# Altium schematic sheet OM-O2P-ETH.SchDoc
size A3
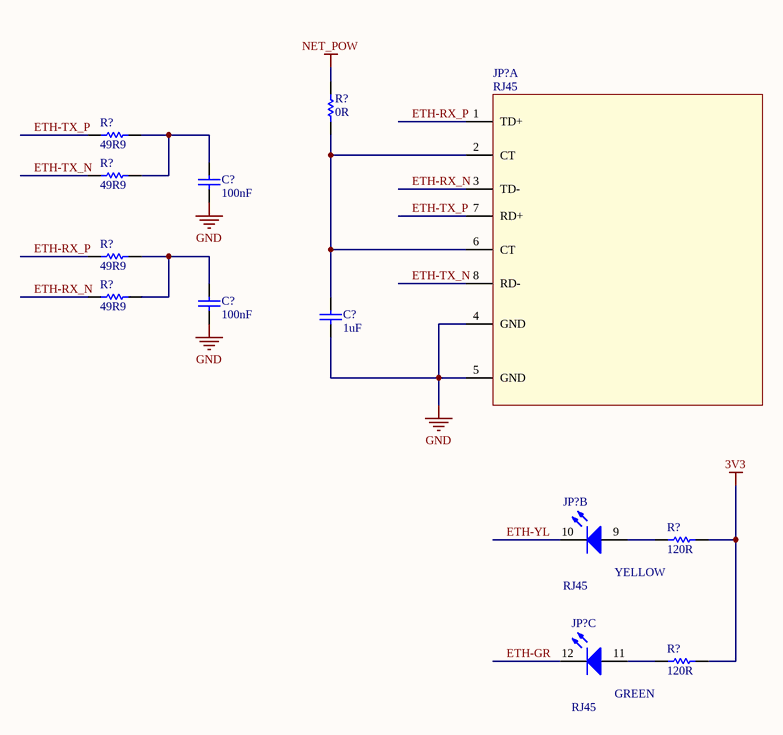
[diagram p0: OM-O2P-ETH.SchDoc]

## Parts
(Parts that share a designator on the sheet are numbered #1, #2 ... from top to bottom, then left to right.)
C?#1  value 100nF  [CAPC0805(2012)100_M]  (hidden comment: CAP 100nF 16V 0805(2012))
C?#2  value 100nF  [CAPC0805(2012)100_M]  (hidden comment: CAP 100nF 16V 0805(2012))
C?#3  value 1uF  [CAPC0805(2012)145_N]  (hidden comment: CAP 1uF 16V 0805(2012))
JP?#1  RJ45  [j0026d21bnl]  (part A of 3)
JP?#2  RJ45  [j0026d21bnl]  (part B of 3)
JP?#3  RJ45  [j0026d21bnl]  (part C of 3)
R?#1  value 0R  [RESC0402(1005)_N]  (hidden comment: Jumper 0402(1005))
R?#2  value 49R9  [RESC0805(2012)_N]  (hidden comment: 49R9 1% 0805(2012))
R?#3  value 49R9  [RESC0805(2012)_N]  (hidden comment: 49R9 1% 0805(2012))
R?#4  value 49R9  [RESC0805(2012)_N]  (hidden comment: 49R9 1% 0805(2012))
R?#5  value 49R9  [RESC0805(2012)_N]  (hidden comment: 49R9 1% 0805(2012))
R?#6  value 120R  [RESC0805(2012)_N]  (hidden comment: 120R 5% 0805(2012))
R?#7  value 120R  [RESC0805(2012)_N]  (hidden comment: 120R 5% 0805(2012))

## Nets
3V3: R?#6.1 R?#7.1
GND: C?#1.1 C?#2.1 C?#3.1 JP?#1.4(GND) JP?#1.5(GND)
NET_POW: R?#1.1
ETH-GR: JP?#3.12(K)
ETH-RX_N: JP?#1.3(TD-) R?#5.1
ETH-RX_P: JP?#1.1(TD+) R?#4.1
ETH-TX_N: JP?#1.8(RD-) R?#3.1
ETH-TX_P: JP?#1.7(RD+) R?#2.1
ETH-YL: JP?#2.10(K)
NetC?#1_2: C?#1.2 R?#2.2 R?#3.2
NetC?#2_2: C?#2.2 R?#4.2 R?#5.2
NetC?#3_2: C?#3.2 JP?#1.2(CT) JP?#1.6(CT) R?#1.2
NetJP?#2_9: JP?#2.9(A) R?#6.2
NetJP?#3_11: JP?#3.11(A) R?#7.2

## Notes on the sheet
- (in symbol CONN_RJ45_J0026D21BNL, part B) YELLOW
- (in symbol CONN_RJ45_J0026D21BNL, part C) GREEN

## Library data of the parts
C?#1 C?#2 = CMP-1036-04400-1: CAP 100nF 16V ±5% 0805 (2012 Metric) Thickness 1mm SMD; Case-EIA: 0805; Tolerance: Â±5%; Case-Metric: 2012; Max Thickness: 1 mm; Technology: SMT; Rated Voltage: 16 V
C?#3 = CMP-1036-04748-1: CAP 1uF 16V ±20% 0805 (2012 Metric) Thickness 1.45mm SMD; Tolerance: Â±20%; Case-Metric: 2012; Case-EIA: 0805; Technology: SMT; Rated Voltage: 16 V; Max Thickness: 1.45 mm
JP?#1-JP?#3 = CONN_RJ45_J0026D21BNL: 1 Port RJ45 Magjack Connector Panel Mount, Through Hole 10/100 Base-TX
R?#1 = CMP-1011-00001-1: Jumper 0402 (1005 Metric); Tolerance: None; Case-Metric: 1005; Case-EIA: 0402; Power: None; Technology: SMT
R?#2-R?#5 = CMP-1013-00363-1: 49R9 0.125W 1% 0805 (2012 Metric)  SMD; Case-Metric: 2012; Case-EIA: 0805; Power: 0.125 W; Tolerance: 1 %; Technology: SMT
R?#6 R?#7 = CMP-1013-00052-1: 120R 0.125W 5% 0805 (2012 Metric)  SMD; Case-Metric: 2012; Case-EIA: 0805; Tolerance: 5 %; Technology: SMT; Power: 0.125 W